# EAGLE schematic pcb (EAGLE 8.0.1)
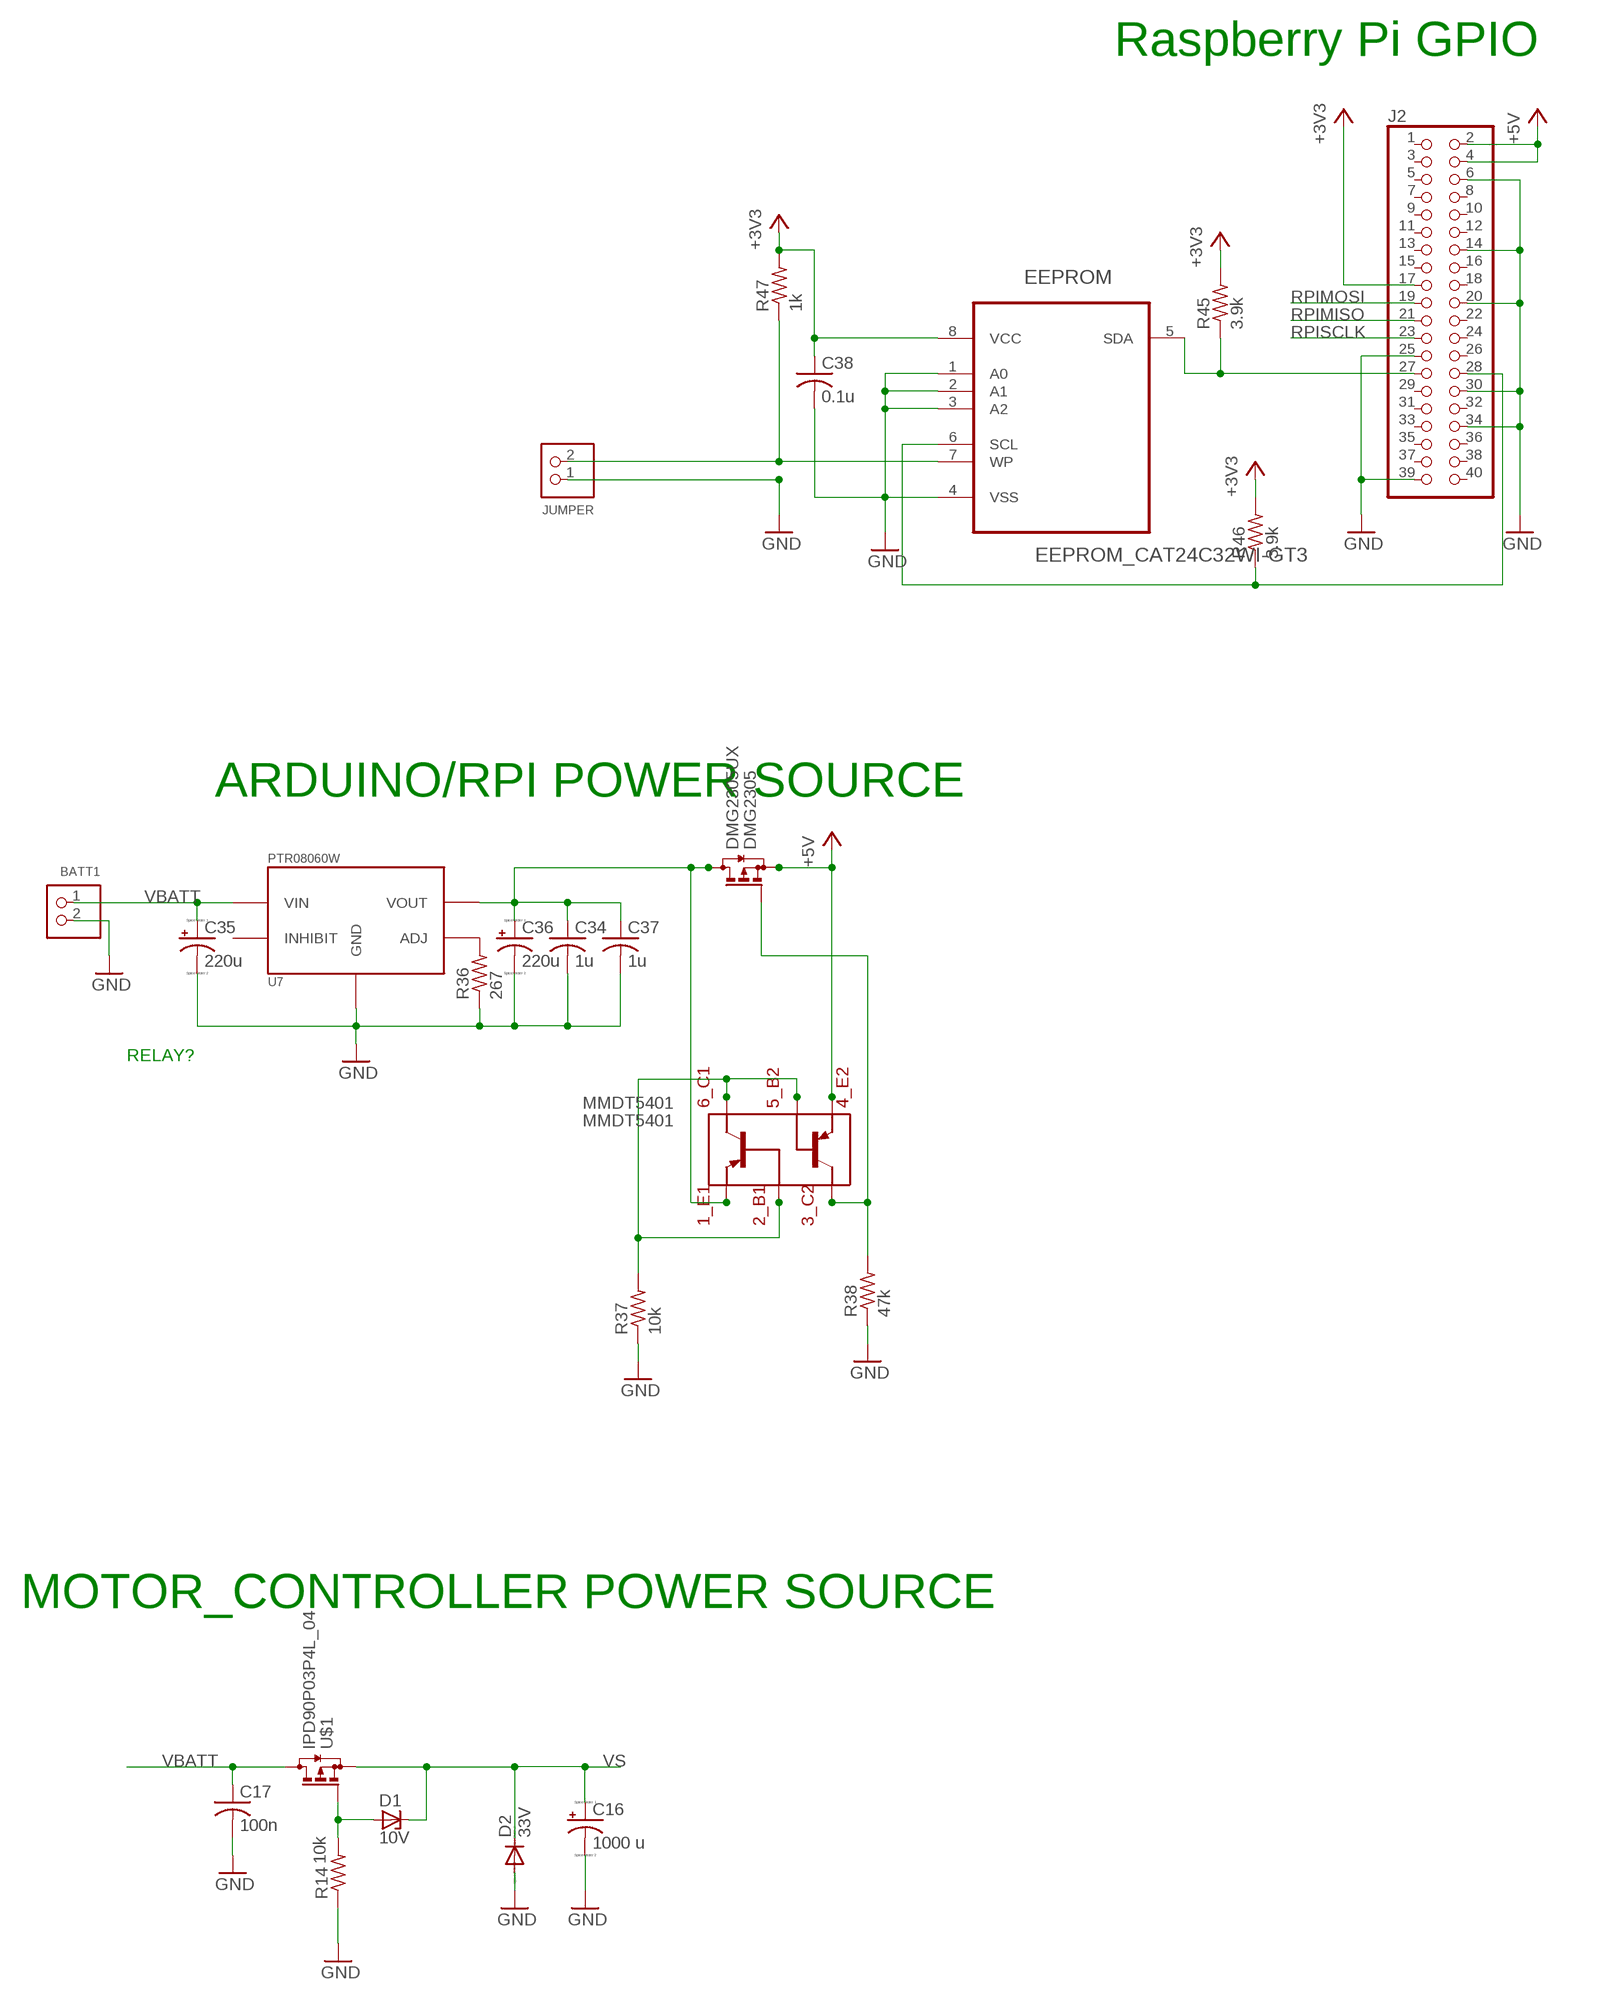
[diagram p0: schematic, sheet 1, part 1 of 2]
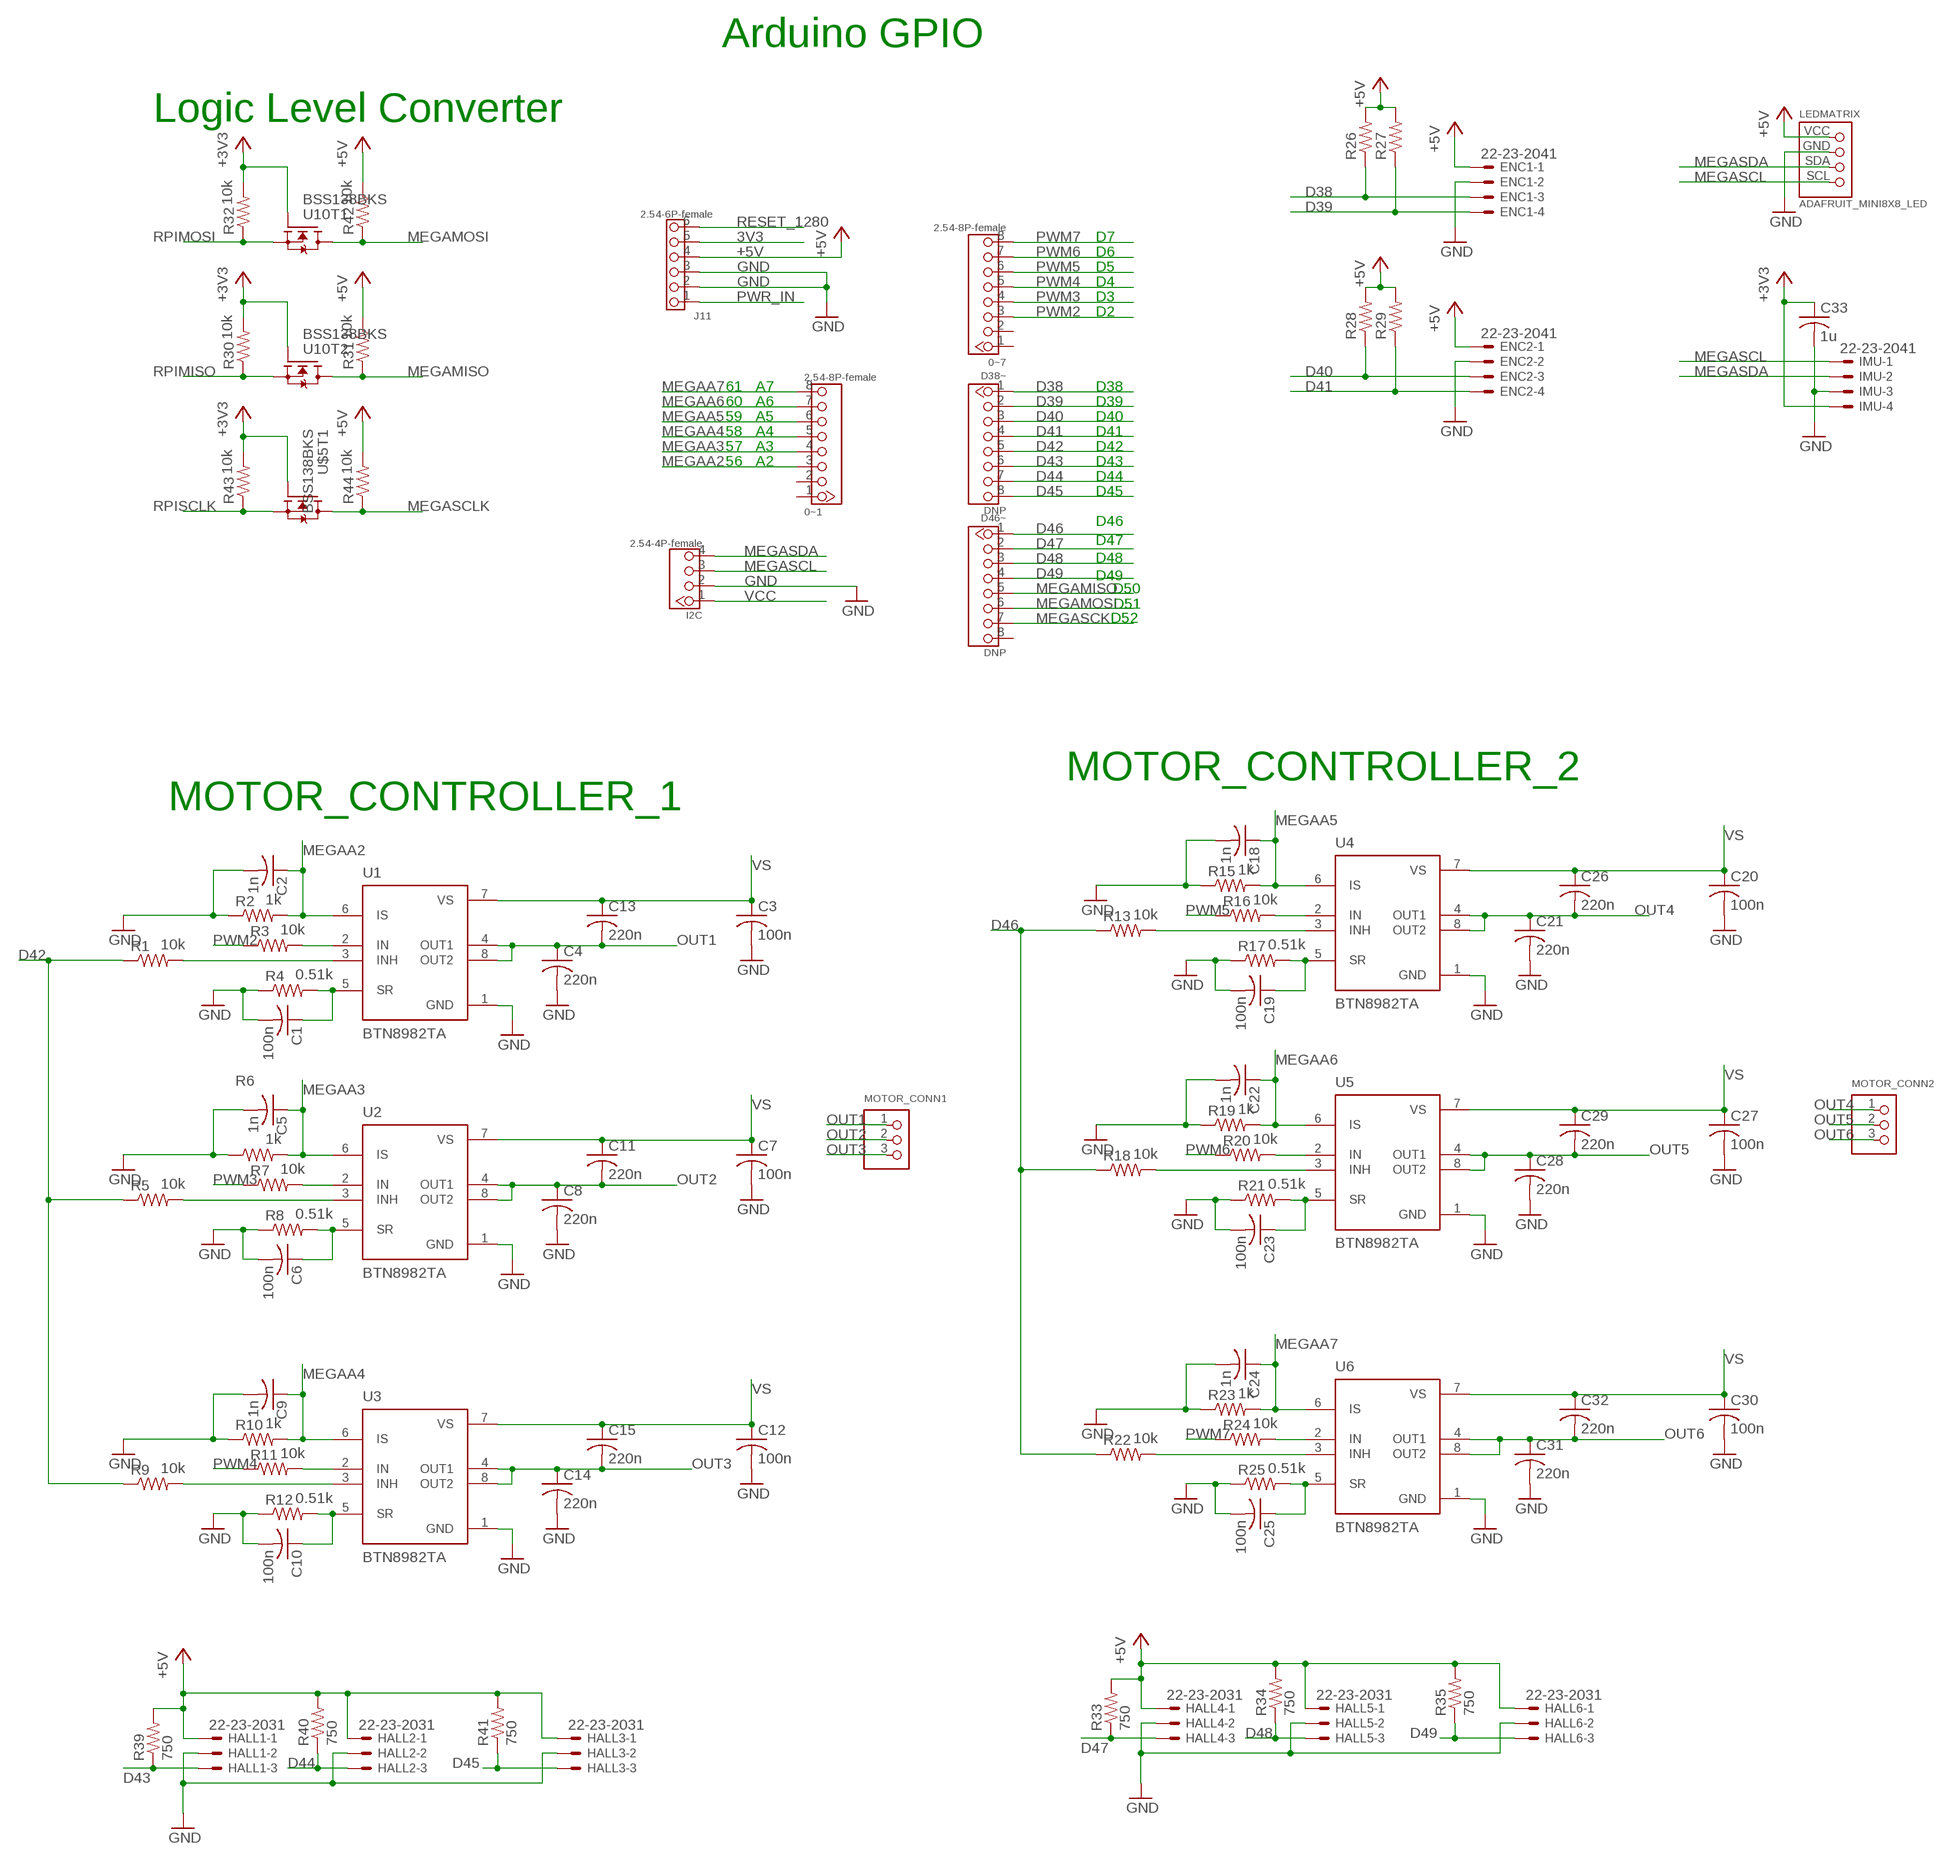
[diagram p1: schematic, sheet 1, part 2 of 2]

## Parts
0~1  2.54-8P-female  HEADER-8P-60/35MIL  [8P-2.54-60/35MIL]
0~7  2.54-8P-female  HEADER-8P-60/35MIL  [8P-2.54-60/35MIL]
BATT1  ULTRAFIT_2CIRC  [ULTRAFIT_2CIRC_RANGLE]
C1  100n  C-USC1206  [C1206]
C2  1n  C-USC1206  [C1206]
C3  100n  C-USC1206  [C1206]
C4  220n  C-USC1206  [C1206]
C5  1n  C-USC1206  [C1206]
C6  100n  C-USC1206  [C1206]
C7  100n  C-USC1206  [C1206]
C8  220n  C-USC1206  [C1206]
C9  1n  C-USC1206  [C1206]
C10  100n  C-USC1206  [C1206]
C11  220n  C-USC1206  [C1206]
C12  100n  C-USC1206  [C1206]
C13  220n  C-USC1206  [C1206]
C14  220n  C-USC1206  [C1206]
C15  220n  C-USC1206  [C1206]
C16  1000 u  CPOL-USE5-13  [E5-13]
C17  100n  C-USC1206  [C1206]
C18  1n  C-USC1206  [C1206]
C19  100n  C-USC1206  [C1206]
C20  100n  C-USC1206  [C1206]
C21  220n  C-USC1206  [C1206]
C22  1n  C-USC1206  [C1206]
C23  100n  C-USC1206  [C1206]
C24  1n  C-USC1206  [C1206]
C25  100n  C-USC1206  [C1206]
C26  220n  C-USC1206  [C1206]
C27  100n  C-USC1206  [C1206]
C28  220n  C-USC1206  [C1206]
C29  220n  C-USC1206  [C1206]
C30  100n  C-USC1206  [C1206]
C31  220n  C-USC1206  [C1206]
C32  220n  C-USC1206  [C1206]
C33  1u  C-USC1206  [C1206]
C34  1u  C-USC1206  [C1206]
C35  220u  CPOL-USE3.5-8  [E3,5-8]
C36  220u  CPOL-USE3.5-8  [E3,5-8]
C37  1u  C-USC1206  [C1206]
C38  0.1u  C-USC1206  [C1206]
D1  10V  ZENER-DIODESOD80C  [SOD80C]
D2  33V  DIODE-MELF-MLL41  [MELF-MLL41]
D38~  DNP  HEADER-8P-60/35MIL  [8P-2.54-60/35MIL]
D46~  DNP  HEADER-8P-60/35MIL  [8P-2.54-60/35MIL]
DMG2305  DMG2305UX  [SOT23-3]
EEPROM  EEPROM_CAT24C32WI-GT3  [SOIC-8]
ENC1  22-23-2041  [22-23-2041]
ENC2  22-23-2041  [22-23-2041]
HALL1  22-23-2031  [22-23-2031]
HALL2  22-23-2031  [22-23-2031]
HALL3  22-23-2031  [22-23-2031]
HALL4  22-23-2031  [22-23-2031]
HALL5  22-23-2031  [22-23-2031]
HALL6  22-23-2031  [22-23-2031]
I2C  2.54-4P-female  HEADER-4P-60/35MIL  [4P-60/35MIL]
IMU  22-23-2041  [22-23-2041]
J2  PINHD-2X20  [2X20]
J11  2.54-6P-female  HEADER-6P-60/35MIL  [6P-2.54-60/35MIL]
JUMPER  02JUMPER  [XJ8B]
LEDMATRIX  ADAFRUIT_MINI8X8_LED  [ADAFRUIT_MINI8X8_BACKPACK]
MMDT5401  MMDT5401  [SOT363]
MOTOR_CONN1  ULTRAFIT_3CIRC  [ULTRAFIT_3CIRC_RANGLE]
MOTOR_CONN2  ULTRAFIT_3CIRC  [ULTRAFIT_3CIRC_RANGLE]
R1  10k  R-US_R1206  [R1206]
R2  1k  R-US_R1206  [R1206]
R3  10k  R-US_R1206  [R1206]
R4  0.51k  R-US_R1206  [R1206]
R5  10k  R-US_R1206  [R1206]
R6  1k  R-US_R1206  [R1206]
R7  10k  R-US_R1206  [R1206]
R8  0.51k  R-US_R1206  [R1206]
R9  10k  R-US_R1206  [R1206]
R10  1k  R-US_R1206  [R1206]
R11  10k  R-US_R1206  [R1206]
R12  0.51k  R-US_R1206  [R1206]
R13  10k  R-US_R1206  [R1206]
R14  10k  R-US_R1206  [R1206]
R15  1k  R-US_R1206  [R1206]
R16  10k  R-US_R1206  [R1206]
R17  0.51k  R-US_R1206  [R1206]
R18  10k  R-US_R1206  [R1206]
R19  1k  R-US_R1206  [R1206]
R20  10k  R-US_R1206  [R1206]
R21  0.51k  R-US_R1206  [R1206]
R22  10k  R-US_R1206  [R1206]
R23  1k  R-US_R1206  [R1206]
R24  10k  R-US_R1206  [R1206]
R25  0.51k  R-US_R1206  [R1206]
R26  R-US_R1206  [R1206]
R27  R-US_R1206  [R1206]
R28  R-US_R1206  [R1206]
R29  R-US_R1206  [R1206]
R30  10k  R-US_R1206  [R1206]
R31  10k  R-US_R1206  [R1206]
R32  10k  R-US_R1206  [R1206]
R33  750  R-US_R1206  [R1206]
R34  750  R-US_R1206  [R1206]
R35  750  R-US_R1206  [R1206]
R36  267  R-US_R1206  [R1206]
R37  10k  R-US_R1206  [R1206]
R38  47k  R-US_R1206  [R1206]
R39  750  R-US_R1206  [R1206]
R40  750  R-US_R1206  [R1206]
R41  750  R-US_R1206  [R1206]
R42  10k  R-US_R1206  [R1206]
R43  10k  R-US_R1206  [R1206]
R44  10k  R-US_R1206  [R1206]
R45  3.9k  R-US_R1206  [R1206]
R46  3.9k  R-US_R1206  [R1206]
R47  1k  R-US_R1206  [R1206]
U1  BTN8982TA  [TO127P1500X440-8N-1]
U2  BTN8982TA  [TO127P1500X440-8N-1]
U3  BTN8982TA  [TO127P1500X440-8N-1]
U4  BTN8982TA  [TO127P1500X440-8N-1]
U5  BTN8982TA  [TO127P1500X440-8N-1]
U6  BTN8982TA  [TO127P1500X440-8N-1]
U7  PTR08060W  [EDP_MODULE]
U10  BSS138BKS  [SOT363]
U$1  IPD90P03P4L_04  [TO252-3-11]
U$5  BSS138BKS  [SOT363]

## Nets
3V3: J11.5
+3V3: C33.1 C38.1 EEPROM.8(VCC) IMU.4 J2.17 R30.2 R32.2 R43.2 R45.2 R46.2 R47.2 U10.2(T1:G) U10.5(T2:G) U$5.2(T1:G)
+5V: DMG2305.2(S) ENC1.1 ENC2.1 HALL1.1 HALL2.1 HALL3.1 HALL4.1 HALL5.1 HALL6.1 J2.2 J2.4 J11.4 LEDMATRIX.VCC MMDT5401.1(E1) R31.2 R33.2 R34.2 R35.2 R39.2 R40.2 R41.2 R42.2 R44.2
D38: D38~.1 ENC1.3 R26.1
D39: D38~.2 ENC1.4 R27.1
D40: D38~.3 ENC2.3 R28.1
D41: D38~.4 ENC2.4 R29.1
D42: D38~.5 R1.1 R5.1 R9.1
D43: D38~.6 HALL1.3 R39.1
D44: D38~.7 HALL2.3 R40.1
D45: D38~.8 HALL3.3 R41.1
D46: D46~.1 R13.1 R18.1 R22.1
D47: D46~.2 HALL4.3 R33.1
D48: D46~.3 HALL5.3 R34.1
D49: D46~.4 HALL6.3 R35.1
GND: BATT1.2 C1.2 C2.2 C3.2 C4.2 C5.2 C6.2 C7.2 C8.2 C9.2 C10.2 C12.2 C14.2 C16.- C17.2 C18.2 C19.2 C20.2 C21.2 C22.2 C23.2 C24.2 C25.2 C27.2 C28.2 C30.2 C31.2 C33.2 C34.2 C35.- C36.- C37.2 C38.2 D2.A EEPROM.1(A0) EEPROM.2(A1) EEPROM.3(A2) EEPROM.4(VSS) ENC1.2 ENC2.2 HALL1.2 HALL2.2 HALL3.2 HALL4.2 HALL5.2 HALL6.2 I2C.2 IMU.3 J2.6 J2.14 J2.20 J2.25 J2.30 J2.34 J2.39 J11.2 J11.3 JUMPER.1 LEDMATRIX.GND R2.1 R4.1 R6.1 R8.1 R10.1 R12.1 R14.1 R15.1 R17.1 R19.1 R21.1 R23.1 R25.1 R36.1 R37.1 R38.1 U1.1(GND) U2.1(GND) U3.1(GND) U4.1(GND) U5.1(GND) U6.1(GND) U7.P3(GND)
MEGAA2: 0~1.3 C2.1 R2.2 U1.6(IS)
MEGAA3: 0~1.4 C5.1 R6.2 U2.6(IS)
MEGAA4: 0~1.5 C9.1 R10.2 U3.6(IS)
MEGAA5: 0~1.6 C18.1 R15.2 U4.6(IS)
MEGAA6: 0~1.7 C22.1 R19.2 U5.6(IS)
MEGAA7: 0~1.8 C24.1 R23.2 U6.6(IS)
MEGAMISO: D46~.5 R31.1 U10.3(T2:D)
MEGAMOSI: D46~.6 R42.1 U10.6(T1:D)
MEGASCK: D46~.7
MEGASCL: I2C.3 IMU.1 LEDMATRIX.SCL
MEGASCLK: R44.1 U$5.6(T1:D)
MEGASDA: I2C.4 IMU.2 LEDMATRIX.SDA
N$1: R1.2 U1.3(INH)
N$2: R26.2 R27.2
N$3: R28.2 R29.2
N$4: R3.2 U1.2(IN)
N$5: C1.1 R4.2 U1.5(SR)
N$6: R5.2 U2.3(INH)
N$7: EEPROM.6(SCL) J2.28 R46.1
N$8: R13.2 U4.3(INH)
N$9: R7.2 U2.2(IN)
N$10: EEPROM.5(SDA) J2.27 R45.1
N$11: C6.1 R8.2 U2.5(SR)
N$12: EEPROM.7(WP) JUMPER.2 R47.1
N$13: R16.2 U4.2(IN)
N$14: C19.1 R17.2 U4.5(SR)
N$15: R9.2 U3.3(INH)
N$17: R11.2 U3.2(IN)
N$18: C10.1 R12.2 U3.5(SR)
N$21: D1.A R14.2 U$1.1(G)
N$23: R18.2 U5.3(INH)
N$24: R20.2 U5.2(IN)
N$25: C23.1 R21.2 U5.5(SR)
N$27: R22.2 U6.3(INH)
N$29: R24.2 U6.2(IN)
N$30: C25.1 R25.2 U6.5(SR)
N$41: R36.2 U7.P5(ADJ)
N$42: DMG2305.1(G) MMDT5401.6(C1) R38.2
N$43: MMDT5401.2(B1) MMDT5401.3(C2) MMDT5401.5(B2) R37.2
OUT1: C4.1 C13.2 MOTOR_CONN1.1 U1.4(OUT1) U1.8(OUT2)
OUT2: C8.1 C11.2 MOTOR_CONN1.2 U2.4(OUT1) U2.8(OUT2)
OUT3: C14.1 C15.2 MOTOR_CONN1.3 U3.4(OUT1) U3.8(OUT2)
OUT4: C21.1 C26.2 MOTOR_CONN2.1 U4.4(OUT1) U4.8(OUT2)
OUT5: C28.1 C29.2 MOTOR_CONN2.2 U5.4(OUT1) U5.8(OUT2)
OUT6: C31.1 C32.2 MOTOR_CONN2.3 U6.4(OUT1) U6.8(OUT2)
PWM2: 0~7.3 R3.1
PWM3: 0~7.4 R7.1
PWM4: 0~7.5 R11.1
PWM5: 0~7.6 R16.1
PWM6: 0~7.7 R20.1
PWM7: 0~7.8 R24.1
PWR_IN: J11.1
RESET_1280: J11.6
RPIMISO: J2.21 R30.1 U10.4(T2:S)
RPIMOSI: J2.19 R32.1 U10.1(T1:S)
RPISCLK: J2.23 R43.1 U$5.1(T1:S)
VBATT: BATT1.1 C17.1 C35.+ U7.P2(VIN) U$1.2(D)
VCC: I2C.1
VOUT: C34.1 C36.+ C37.1 DMG2305.3(D) MMDT5401.4(E2) U7.P4(VOUT)
VS: C3.1 C7.1 C11.1 C12.1 C13.1 C15.1 C16.+ C20.1 C26.1 C27.1 C29.1 C30.1 C32.1 D1.C D2.C U1.7(VS) U2.7(VS) U3.7(VS) U4.7(VS) U5.7(VS) U6.7(VS) U$1.3(S)
Unconnected: 0~1.1 0~1.2 0~7.1 0~7.2 D46~.8 J2.1 J2.3 J2.5 J2.7 J2.8 J2.9 J2.10 J2.11 J2.12 J2.13 J2.15 J2.16 J2.18 J2.22 J2.24 J2.26 J2.29 J2.31 J2.32 J2.33 J2.35 J2.36 J2.37 J2.38 J2.40 U7.P1(INHIBIT) U$5.3(T2:D) U$5.4(T2:S) U$5.5(T2:G)

## Notes on the sheet
- Arduino GPIO
- Raspberry Pi GPIO
- Logic Level Converter
- D7
- D6
- D5
- D4
- D3
- D2
- 61 | A7 | D38
- 60 | A6 | D39
- 59 | A5 | D40
- 58 | A4 | D41
- 57 | A3 | D42
- 56 | A2 | D43
- D44
- D45
- D46
- D47
- D48
- D49
- D50
- D51
- D52
- ARDUINO/RPI POWER SOURCE
- MOTOR_CONTROLLER_2
- MOTOR_CONTROLLER_1
- RELAY?
- MOTOR_CONTROLLER POWER SOURCE

## Library data of the parts
0~1 0~7 D38~ D46~ = Connector:HEADER-8P
BATT1 = rpibout:ULTRAFIT_2CIRC: Molex Ultra-Fit Right Angle Header, 3.50mm Pitch, Single Row, 2 Circuits
C1-C15 C17-C34 C37 C38 = resistor:C-US: CAPACITOR, American symbol
C16 C35 C36 = resistor:CPOL-US: POLARIZED CAPACITOR, American symbol
D1 = diode:ZENER-DIODE: Z-Diode
D2 = diode:DIODE-: DIODE
DMG2305 = rpibout:DMG2305UX: DMG2305 https://www.diodes.com/assets/Datasheets/DMG2305UX.pdf
EEPROM = rpibout:EEPROM_CAT24C32WI-GT3: CAT24C32WI-GT3 SOIC8 http://www.onsemi.cn/PowerSolutions/document/CAT24C32-D.PDF
ENC1 ENC2 IMU = con-molex:22-23-2041: .100" (2.54mm) Center Header - 4 Pin; MF: MOLEX; MPN: 22-23-2041; OC_FARNELL: 1462920; OC_NEWARK: 38C0355
HALL1-HALL6 = con-molex:22-23-2031: .100" (2.54mm) Center Header - 3 Pin; MF: MOLEX; MPN: 22-23-2031; OC_FARNELL: 1462950; OC_NEWARK: 30C0862
I2C = Connector:HEADER-4P
J2 = pinhead:PINHD-2X20: PIN HEADER
J11 = Connector:HEADER-6P
JUMPER = rpibout:02JUMPER
LEDMATRIX = rpibout:ADAFRUIT_MINI8X8_LED: Adafruit Mini 8x8 LED Matrix Backpack
MMDT5401 = rpibout:MMDT5401: 150V DUAL PNP SMALL SIGNAL TRANSISTOR IN SOT363
MOTOR_CONN1 MOTOR_CONN2 = rpibout:ULTRAFIT_3CIRC
R1-R47 = resistor:R-US_: RESISTOR, American symbol
U1-U6 = rpibout:BTN8982TA: BTN8982TA
U7 = rpibout:PTR08060W: PTR08060W Texas Instruments Buck Power Module
U10 U$5 = rpibout:BSS138BKS: BSS138BKS Dual N-MOSFET
U$1 = rpibout:IPD90P03P4L_04: IPD90P03P4L_04 PG-TO-3-11 P-MOSFET REVERSE BATTERY PROTECTION

## Net classes
1 pwr: width 0.305 mm
3 vcc: width 0.152 mm, drill 0.305 mm, clearance 0.152 mm